# EAGLE design CC3200_Breakout (EAGLE 8.1.0)

## Sheet 1 of 2
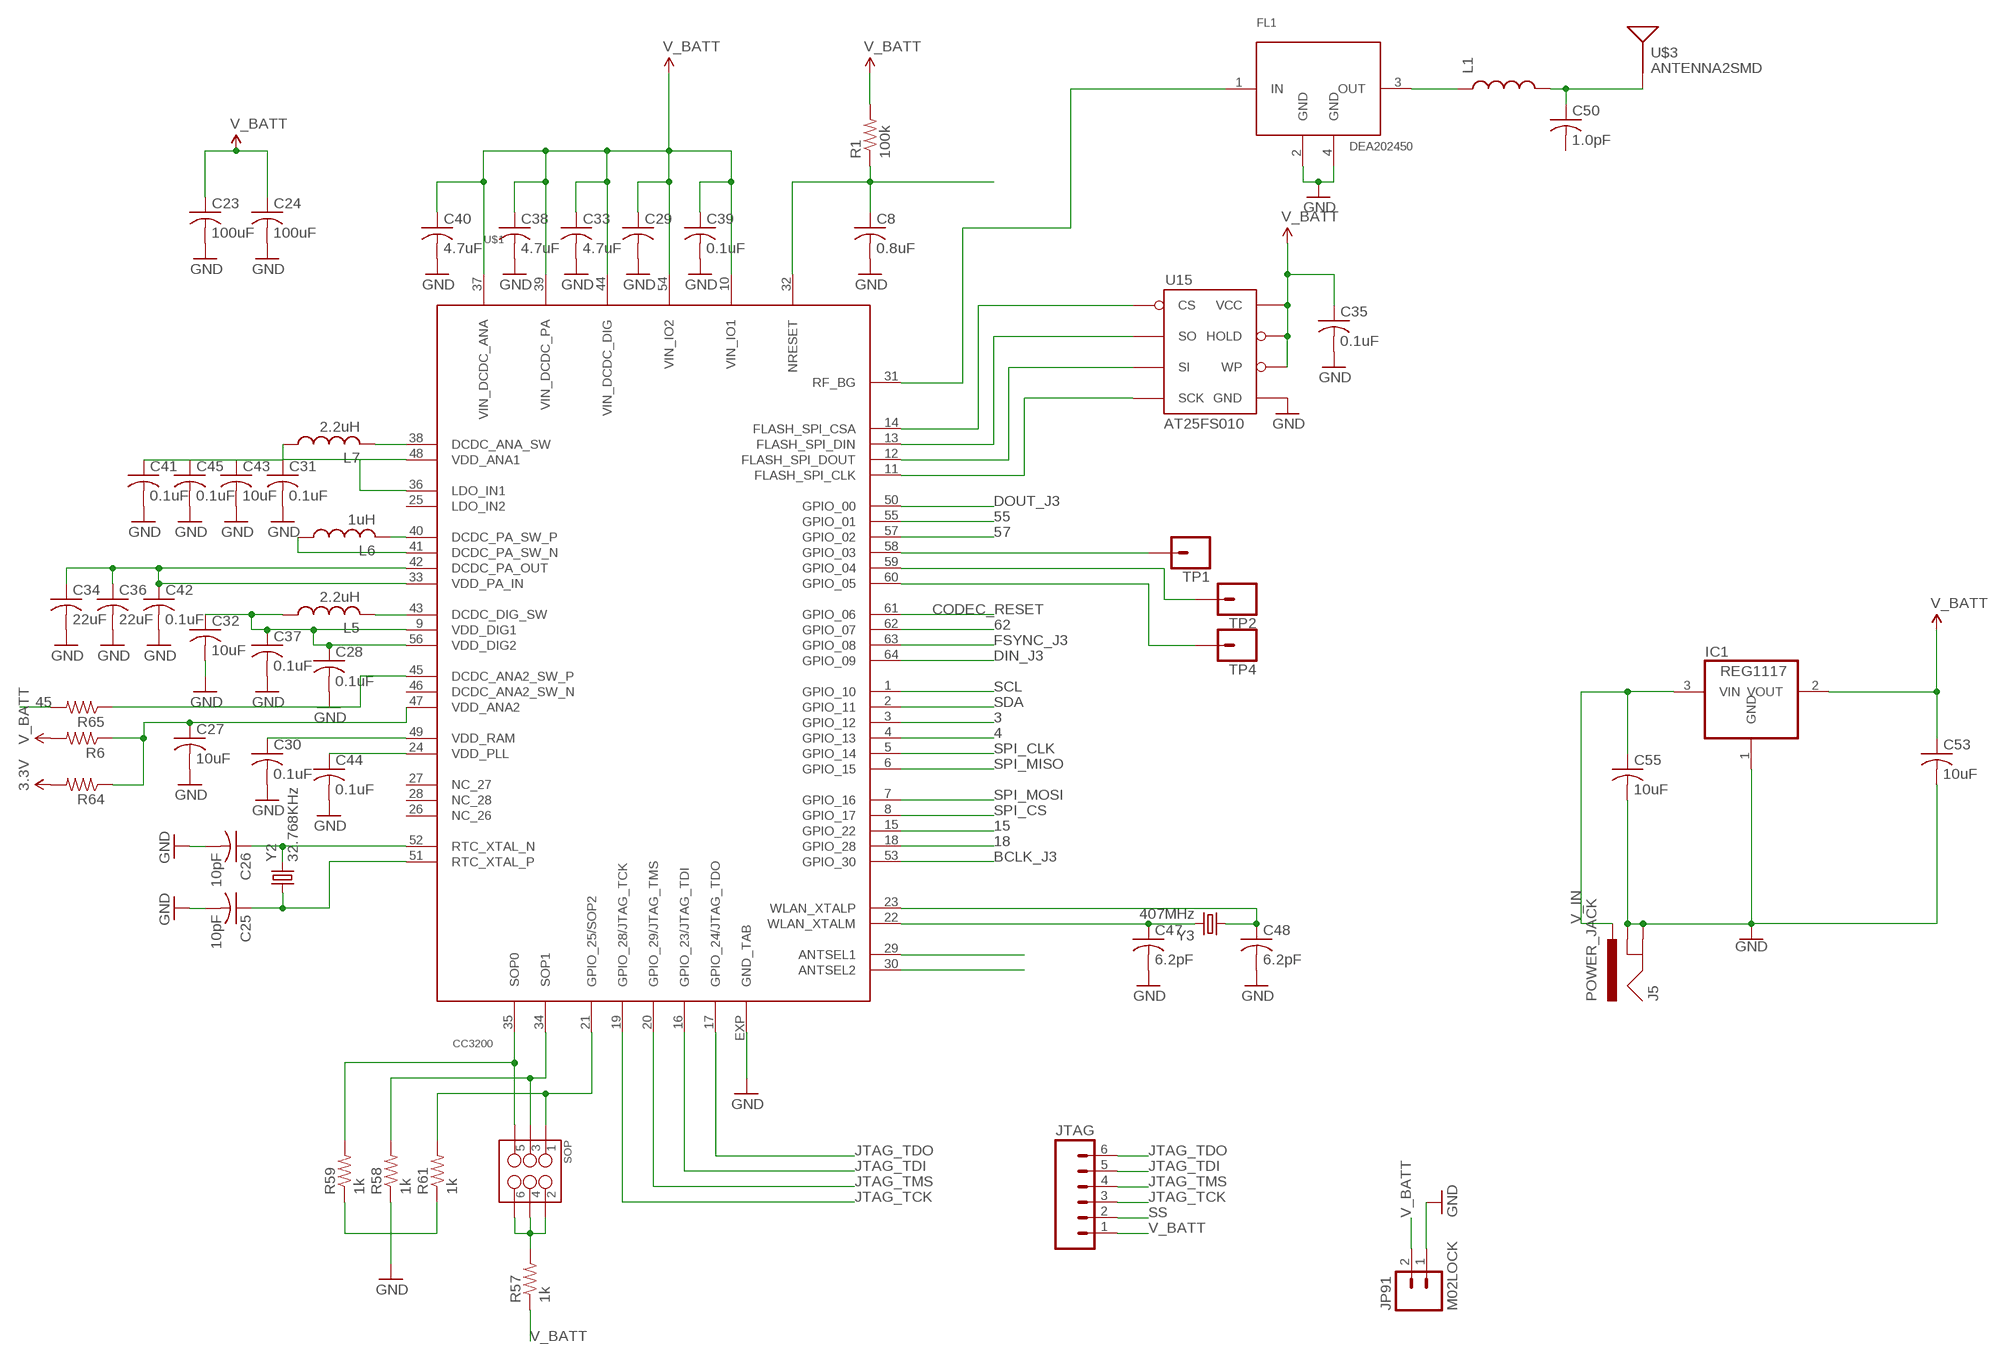
[diagram p0: schematic, sheet 1]

### Parts
C8  0.8uF  C-USC0402K  [C0402K]
C23  100uF  C-USC0402K  [C0402K]
C24  100uF  C-USC0402K  [C0402K]
C25  10pF  C-USC0402K  [C0402K]
C26  10pF  C-USC0402K  [C0402K]
C27  10uF  C-USC0402K  [C0402K]
C28  0.1uF  C-USC0402K  [C0402K]
C29  C-USC0402K  [C0402K]
C30  0.1uF  C-USC0402K  [C0402K]
C31  0.1uF  C-USC0402K  [C0402K]
C32  10uF  C-USC0402K  [C0402K]
C33  4.7uF  C-USC0402K  [C0402K]
C34  22uF  C-USC0402K  [C0402K]
C35  0.1uF  C-USC0402K  [C0402K]
C36  22uF  C-USC0402K  [C0402K]
C37  0.1uF  C-USC0402K  [C0402K]
C38  4.7uF  C-USC0402K  [C0402K]
C39  0.1uF  C-USC0402K  [C0402K]
C40  4.7uF  C-USC0402K  [C0402K]
C41  0.1uF  C-USC0402K  [C0402K]
C42  0.1uF  C-USC0402K  [C0402K]
C43  10uF  C-USC0402K  [C0402K]
C44  0.1uF  C-USC0402K  [C0402K]
C45  0.1uF  C-USC0402K  [C0402K]
C47  6.2pF  C-USC0402K  [C0402K]
C48  6.2pF  C-USC0402K  [C0402K]
C50  1.0pF  C-USC0402K  [C0402K]
C53  10uF  C-USC1206  [C1206]
C55  10uF  C-USC1206  [C1206]
FL1  DEA202450  [DEA202450]
IC1  REG1117  [SOT223]
J5  POWER_JACK  [POWER_JACK_PTH]
JP91  M02LOCK  [1X02_LOCK]
JTAG  M06SILK_FEMALE_PTH  [1X06]
L1  INDUCTOR-SPARKFUN0402  [C0402]
L5  2.2uH  L-USL2012C  [L2012C]
L6  1uH  L-USL2012C  [L2012C]
L7  2.2uH  L-USL2012C  [L2012C]
R1  100k  R-US_R0402  [R0402]
R6  R-US_R0402  [R0402]
R57  1k  R-US_R0402  [R0402]
R58  1k  R-US_R0402  [R0402]
R59  1k  R-US_R0402  [R0402]
R61  1k  R-US_R0402  [R0402]
R64  R-US_R0402  [R0402]
R65  R-US_R0402  [R0402]
SOP  M03X22X3_SILK_MALE_PTH  [2X3]
TP1  CONN_01  [1X01]
TP2  CONN_01  [1X01]
TP4  CONN_01  [1X01]
U15  AT25FS010  [SO08WIDE]
U$1  CC3200  [PVQFN-N64]
U$3  ANTENNA2SMD  [ANTENNA-CHIP2]
Y2  32.768KHz  CRYSTAL5X3  [CRYSTAL-SMD-5X3]
Y3  407MHz  CRYSTAL5X3  [CRYSTAL-SMD-5X3]

### Nets
3: U$1.3(GPIO_12)
3.3V: R64.2
4: U$1.4(GPIO_13)
15: U$1.15(GPIO_22)
18: U$1.18(GPIO_28)
45: R65.2
55: U$1.55(GPIO_01)
57: U$1.57(GPIO_02)
58: TP1.1 U$1.58(GPIO_03)
59: TP2.1 U$1.59(GPIO_04)
60: TP4.1 U$1.60(GPIO_05)
62: U$1.62(GPIO_07)
BCLK_J3: U$1.53(GPIO_30) ; also sheet 2
CODEC_RESET: U$1.61(GPIO_06) ; also sheet 2
DIN_J3: U$1.64(GPIO_09) ; also sheet 2
DOUT_J3: U$1.50(GPIO_00) ; also sheet 2
FSYNC_J3: U$1.63(GPIO_08) ; also sheet 2
JTAG_TCK: JTAG.3 U$1.19(GPIO_28/JTAG_TCK)
JTAG_TDI: JTAG.5 U$1.16(GPIO_23/JTAG_TDI)
JTAG_TDO: JTAG.6 U$1.17(GPIO_24/JTAG_TDO)
JTAG_TMS: JTAG.4 U$1.20(GPIO_29/JTAG_TMS)
N$1: C26.1 U$1.52(RTC_XTAL_N) Y2.3
N$2: C25.1 U$1.51(RTC_XTAL_P) Y2.1
N$3: C31.1 C41.1 C43.1 C45.1 L7.1 U$1.36(LDO_IN1) U$1.48(VDD_ANA1)
N$4: L7.2 U$1.38(DCDC_ANA_SW)
N$5: U$1.29(ANTSEL1)
N$6: R57.2 SOP.2 SOP.4 SOP.6
N$7: L6.2 U$1.40(DCDC_PA_SW_P)
N$8: L6.1 U$1.41(DCDC_PA_SW_N)
N$9: FL1.1(IN) U$1.31(RF_BG)
N$10: C34.1 C36.1 C42.1 U$1.33(VDD_PA_IN) U$1.42(DCDC_PA_OUT)
N$11: L5.2 U$1.43(DCDC_DIG_SW)
N$12: R65.1 U$1.45(DCDC_ANA2_SW_P)
N$13: R59.2 SOP.5 U$1.35(SOP0)
N$14: C8.1 R1.1 U$1.32(NRESET)
N$17: C28.1 C32.1 C37.1 L5.1 U$1.9(VDD_DIG1) U$1.56(VDD_DIG2)
N$18: C30.1 U$1.49(VDD_RAM)
N$19: C44.1 U$1.24(VDD_PLL)
N$20: C27.1 R6.1 R64.1 U$1.47(VDD_ANA2)
N$21: R58.2 SOP.3 U$1.34(SOP1)
N$22: R61.2 SOP.1 U$1.21(GPIO_25/SOP2)
N$27: U$1.30(ANTSEL2)
N$28: C47.1 U$1.22(WLAN_XTALM) Y3.3
N$29: C48.1 U$1.23(WLAN_XTALP) Y3.1
N$30: U15.1(CS) U$1.14(FLASH_SPI_CSA)
N$31: U15.2(SO) U$1.13(FLASH_SPI_DIN)
N$32: U15.5(SI) U$1.12(FLASH_SPI_DOUT)
N$33: U15.6(SCK) U$1.11(FLASH_SPI_CLK)
N$36: FL1.3(OUT) L1.1
SCL: U$1.1(GPIO_10) ; also sheet 2
SDA: U$1.2(GPIO_11) ; also sheet 2
SPI_CLK: U$1.5(GPIO_14)
SPI_CS: U$1.8(GPIO_17)
SPI_MISO: U$1.6(GPIO_15)
SPI_MOSI: U$1.7(GPIO_16)
SS: C8.2 C23.2 C24.2 C25.2 C26.2 C27.2 C28.2 C29.2 C30.2 C31.2 C32.2 C33.2 C34.2 C35.2 C36.2 C37.2 C38.2 C39.2 C40.2 C41.2 C42.2 C43.2 C44.2 C45.2 C47.2 C48.2 C50.1 C53.2 C55.2 FL1.2(GND) FL1.4(GND) IC1.1(GND) J5.GND J5.GNDBREAK JP91.1 JTAG.2 L1.2 R58.1 R59.1 R61.1 U15.4(GND) U$1.EXP(GND_TAB) U$3.FEED(SIGNAL) ; supply symbol labelled GND ; also sheet 2
V_BATT: C23.1 C24.1 C29.1 C33.1 C35.1 C38.1 C39.1 C40.1 C53.1 IC1.2(VOUT) JP91.2 JTAG.1 R1.2 R6.2 R57.1 U15.3(WP) U15.7(HOLD) U15.8(VCC) U$1.10(VIN_IO1) U$1.37(VIN_DCDC_ANA) U$1.39(VIN_DCDC_PA) U$1.44(VIN_DCDC_DIG) U$1.54(VIN_IO2)
V_IN: C55.1 IC1.3(VIN) J5.PWR
Unconnected: C50.2 U$1.25(LDO_IN2) U$1.26(NC_26) U$1.27(NC_27) U$1.28(NC_28) U$1.46(DCDC_ANA2_SW_N)

## Sheet 2 of 2
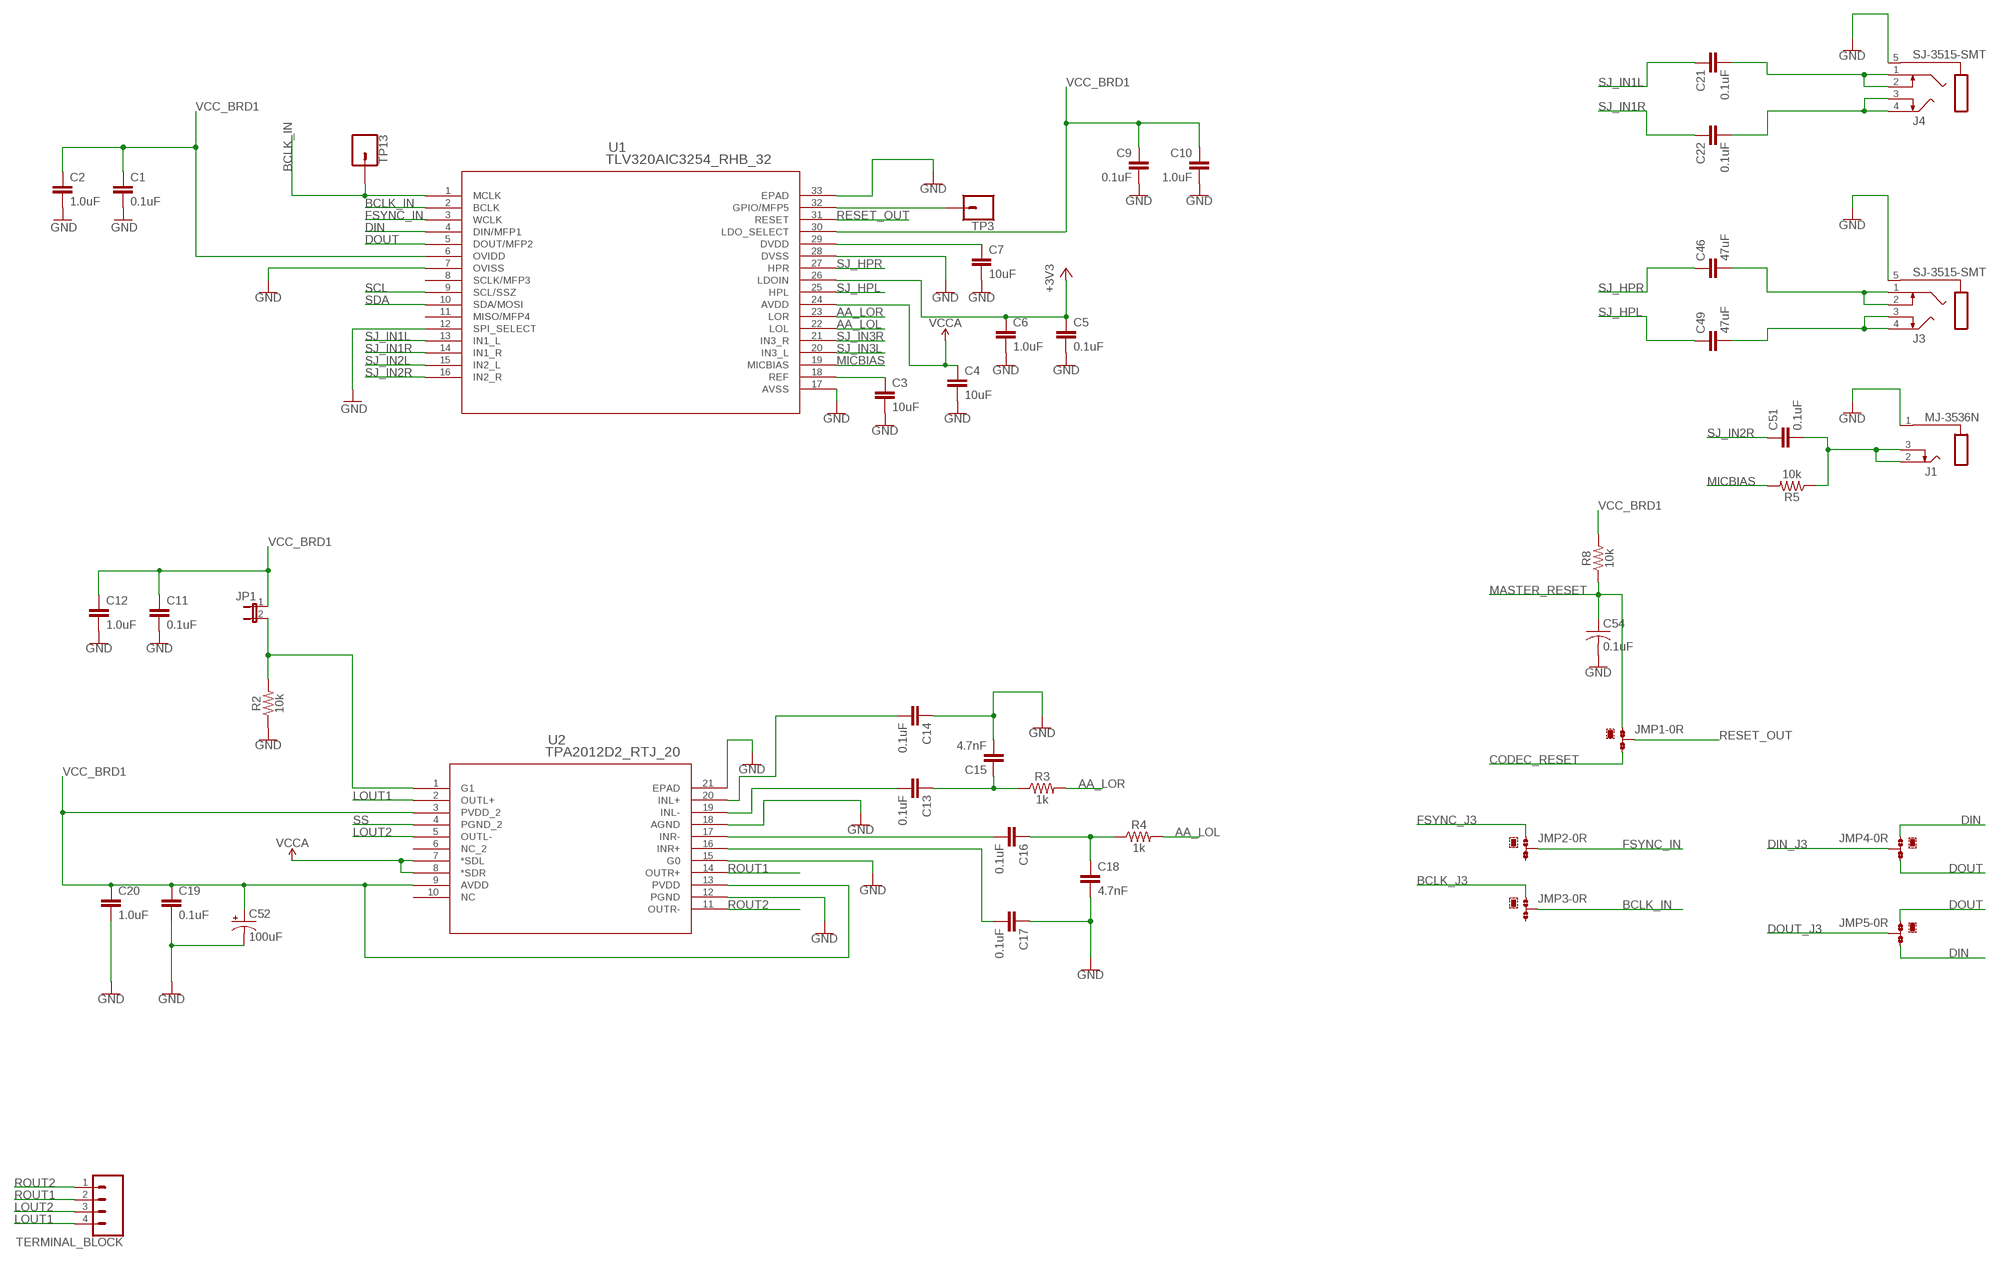
[diagram p1: schematic, sheet 2]

### Parts
C1  0.1uF  0.1UF-0402-16V-10%  [0402]
C2  1.0uF  1.0UF-0402-16V-10%  [0402]
C3  10uF  10UF-0603-6.3V-20%  [0603]
C4  10uF  10UF-0603-6.3V-20%  [0603]
C5  0.1uF  0.1UF-0402-16V-10%  [0402]
C6  1.0uF  1.0UF-0402-16V-10%  [0402]
C7  10uF  10UF-0603-6.3V-20%  [0603]
C9  0.1uF  0.1UF-0402-16V-10%  [0402]
C10  1.0uF  1.0UF-0402-16V-10%  [0402]
C11  0.1uF  0.1UF-0402-16V-10%  [0402]
C12  1.0uF  1.0UF-0402-16V-10%  [0402]
C13  0.1uF  0.1UF-0402-16V-10%  [0402]
C14  0.1uF  0.1UF-0402-16V-10%  [0402]
C15  4.7nF  4.7NF-50V-10%(0603)  [0603]
C16  0.1uF  0.1UF-0402-16V-10%  [0402]
C17  0.1uF  0.1UF-0402-16V-10%  [0402]
C18  4.7nF  4.7NF-50V-10%(0603)  [0603]
C19  0.1uF  0.1UF-0402-16V-10%  [0402]
C20  1.0uF  1.0UF-0402-16V-10%  [0402]
C21  0.1uF  0.1UF-0402-16V-10%  [0402]
C22  0.1uF  0.1UF-0402-16V-10%  [0402]
C46  47uF  0.1UF-0603-25V-5%  [0603]
C49  47uF  0.1UF-0603-25V-5%  [0603]
C51  0.1uF  0.1UF-0402-16V-10%  [0402]
C52  100uF  100UF-POLAR-25V-20%(ELEC)  [PANASONIC_D]
C54  0.1uF  C-USC0402K  [C0402K]
J1  MJ-3536N  [MJ-3536N]
J3  SJ-3515-SMT  [SJ-3515-SMT]
J4  SJ-3515-SMT  [SJ-3515-SMT]
JMP1  0R-JUMPA  [A0R-JMP]
JMP2  0R-JUMPA  [A0R-JMP]
JMP3  0R-JUMPA  [A0R-JMP]
JMP4  0R-JUMPA  [A0R-JMP]
JMP5  0R-JUMPA  [A0R-JMP]
JP1  JUMPER-2PTH  [1X02]
R2  10k  10KOHM-0603-1/10W-1%  [0603]
R3  1k  1KOHM-0603-1/10W-1%  [0603]
R4  1k  1KOHM-0603-1/10W-1%  [0603]
R5  10k  10KOHM-0603-1/10W-1%  [0603]
R8  10k  10KOHM-0603-1/10W-1%  [0603]
TERMINAL_BLOCK  CONN_04JST-PTH  [JST-4-PTH]
TP3  CONN_01  [1X01]
TP13  CONN_01  [1X01]
U1  TLV320AIC3254_RHB_32  [RHB32_3P45X3P45]
U2  TPA2012D2_RTJ_20  [RTJ20_2P7X2P7]

### Nets
+3V3: C5.1 C6.1 U1.26(LDOIN)
AA_LOL: R4.2 U1.22(LOL)
AA_LOR: R3.2 U1.23(LOR)
BCLK_IN: JMP3.2 TP13.1 U1.1(MCLK) U1.2(BCLK)
BCLK_J3: JMP3.1 ; also sheet 1
CODEC_RESET: JMP1.3 ; also sheet 1
DIN: JMP4.1 JMP5.3 U1.4(DIN/MFP1)
DIN_J3: JMP4.2 ; also sheet 1
DOUT: JMP4.3 JMP5.1 U1.5(DOUT/MFP2)
DOUT_J3: JMP5.2 ; also sheet 1
FSYNC_IN: JMP2.2 U1.3(WCLK)
FSYNC_J3: JMP2.1 ; also sheet 1
LOUT1: TERMINAL_BLOCK.4 U2.2(OUTL+)
LOUT2: TERMINAL_BLOCK.3 U2.5(OUTL-)
MASTER_RESET: C54.1 JMP1.1 R8.1
MICBIAS: R5.2 U1.19(MICBIAS)
N$25: C3.1 U1.18(REF)
N$34: TP3.1 U1.32(GPIO/MFP5)
N$35: JP1.2 R2.2 U2.1(G1)
N$37: C7.1 U1.29(DVDD)
N$38: C22.2 J4.3(TS) J4.4(T)
N$39: C14.2 U2.20(INL+)
N$41: C13.1 C15.1 R3.1
N$42: C13.2 U2.19(INL-)
N$43: C16.2 U2.17(INR-)
N$44: C16.1 C18.1 R4.1
N$45: C17.2 U2.16(INR+)
N$46: C21.2 J4.1(R) J4.2(RS)
N$55: C46.2 J3.1(R) J3.2(RS)
N$56: C49.2 J3.3(TS) J3.4(T)
N$57: C51.2 J1.2(T) J1.3(TS) R5.1
RESET_OUT: JMP1.2 U1.31(RESET)
ROUT1: TERMINAL_BLOCK.2 U2.14(OUTR+)
ROUT2: TERMINAL_BLOCK.1 U2.11(OUTR-)
SCL: U1.9(SCL/SSZ) ; also sheet 1
SDA: U1.10(SDA/MOSI) ; also sheet 1
SJ_HPL: C49.1 U1.25(HPL)
SJ_HPR: C46.1 U1.27(HPR)
SJ_IN1L: C21.1 U1.13(IN1_L)
SJ_IN1R: C22.1 U1.14(IN1_R)
SJ_IN2L: U1.15(IN2_L)
SJ_IN2R: C51.1 U1.16(IN2_R)
SJ_IN3L: U1.20(IN3_L)
SJ_IN3R: U1.21(IN3_R)
SS: C1.2 C2.2 C3.2 C4.2 C5.2 C6.2 C7.2 C9.2 C10.2 C11.2 C12.2 C14.1 C15.2 C17.1 C18.2 C19.2 C20.2 C52.- C54.2 J1.1(S) J3.5(S) J4.5(S) R2.1 U1.7(OVISS) U1.12(SPI_SELECT) U1.17(AVSS) U1.28(DVSS) U1.33(EPAD) U2.4(PGND_2) U2.12(PGND) U2.15(G0) U2.18(AGND) U2.21(EPAD) ; supply symbol labelled GND ; also sheet 1
VCC_BRD1: C1.1 C2.1 C9.1 C10.1 C11.1 C12.1 C19.1 C20.1 C52.+ JP1.1 R8.2 U1.6(OVIDD) U1.30(LDO_SELECT) U2.3(PVDD_2) U2.9(AVDD) U2.13(PVDD)
VCCA: C4.1 U1.24(AVDD) U2.7(*SDL) U2.8(*SDR)
Unconnected: JMP2.3 JMP3.3 U1.8(SCLK/MFP3) U1.11(MISO/MFP4) U2.6(NC_2) U2.10(NC)

## Library data of the parts
C1 C5 C9 C11 C13 C14 C16 C17 C19 C21 C22 C51 = SparkFun-Capacitors:0.1UF: 0.1µF ceramic capacitors A capacitor is a passive two-terminal electrical component used to store electrical energy temporarily in an electric field.; PROD_ID: CAP-12416
C2 C6 C10 C12 C20 = SparkFun-Capacitors:1.0UF: 1µF ceramic capacitors A capacitor is a passive two-terminal electrical component used to store electrical energy temporarily in an electric field.; PROD_ID: CAP-12417
C3 C4 C7 = SparkFun-Capacitors:10UF: 10.0µF ceramic capacitors A capacitor is a passive two-terminal electrical component used to store electrical energy temporarily in an electric field.; PROD_ID: CAP-11015
C8 C23-C45 C47 C48 C50 C54 = resistor:C-US: CAPACITOR, American symbol
C15 C18 = SparkFun-Retired:4.7NF-50V-10%(0603): CAP-11378; PROD_ID: CAP-11378
C46 C49 = SparkFun-Capacitors:0.1UF: 0.1µF ceramic capacitors A capacitor is a passive two-terminal electrical component used to store electrical energy temporarily in an electric field.; PROD_ID: CAP-08604; VALUE: 0.1uF
C52 = SparkFun-Capacitors:100UF-POLAR: 100µF polarized capacitors A capacitor is a passive two-terminal electrical component used to store electrical energy temporarily in an electric field.; PROD_ID: CAP-12547
C53 C55 = rcl:C-US: CAPACITOR, American symbol
FL1 = DEA202450:DEA202450
IC1 = burr-brown:REG1117: 800mA and 1A Low Dropout (LDO) Positive Regulator 1.8V, 2.5V, 2.85V, 3.3V, 5V, and Adj; MPN: REG1117; OC_FARNELL: 1097566; OC_NEWARK: 14P6981
J1 = con-cuistack:MJ-3536N: Mono Audio Jack, 3.5 MM
J3 J4 = con-cuistack:SJ-3515: 3.5 Stereo Audio Jack (SMT)
J5 = SparkFun-Connectors:POWER_JACK: Power Jack Connector This is the standard 5.5mm barrel jack for power. The PTH is the most common, proven, reliable, footprint. The Slot footprint only works if the mill layer is transmitted to the PCB fab house so be warned. Here are the connectors we sell at SparkFun: DC Barrel Power Jack/Connector <https://www.sparkfun.com/products/119> (PRT-00119) DC Barrel Power Jack/Connector (SMD) <https://www.sparkfun.com/products/12748> (PRT-12748) DC Barrel Jack Adapter - Breadboard Compatible <https://www.sparkfun.com/products/10811> (PRT-10811) It is used on this SparkFun product (and many, many others): SparkFun RedBoard - Programmed with Arduino <https://www.sparkfun.com/products/12757> (DEV-12757) Also, if you need a mating power supply or connector, please check these out: Wall Adapter Power Supply - 9VDC 650mA <https://www.sparkfun.com/products/298> (TOL-00298) DC Barrel Jack Adapter - Male <https://www.sparkfun.com/products/10287> (PRT-10287); PROD_ID: CONN-08197
JMP1-JMP5 = jump-0r-smd:0R-JUMP: SMD 0R 0805 Jumper
JP1 = SparkFun-Retired:JUMPER-2: Jumper Basic 0.1" spaced jumper. Use with breakaway headers.
JP91 = SparkFun-Connectors:M02: Standard 2-pin 0.1" header. Use with - straight break away headers ( PRT-00116) - right angle break away headers (PRT-00553) - swiss pins (PRT-00743) - machine pins (PRT-00117) - female headers (PRT-00115) Molex polarized connector foot print use with: PRT-08233 with associated crimp pins and housings. 2.54_SCREWTERM for use with PRT-10571. 3.5mm Screw Terminal footprints for PRT-08084 5mm Screw Terminal footprints for use with PRT-08432
JTAG = SparkFun-Connectors:M06: Header 6 Standard 6-pin 0.1" header. Use with straight break away headers (SKU : PRT-00116), right angle break away headers (PRT-00553), swiss pins (PRT-00743), machine pins (PRT-00117), and female headers (PRT-00115). Molex polarized connector foot print use with SKU : PRT-08094 with associated crimp pins and housings. NOTES ON THE VARIANTS LOCK and LOCK_LONGPADS... This footprint was designed to help hold the alignment of a through-hole component (i.e. 6-pin header) while soldering it into place. You may notice that each hole has been shifted either up or down by 0.005 of an inch from it's more standard position (which is a perfectly straight line). This slight alteration caused the pins (the squares in the middle) to touch the edges of the holes. Because they are alternating, it causes a "brace" to hold the component in place. 0.005 has proven to be the perfect amount of "off-center" position when using our standard breakaway headers. Although looks a little odd when you look at the bare footprint, once you have a header in there, the alteration is very hard to notice. Also,if you push a header all the way into place, it is covered up entirely on the bottom side. This idea of altering the position of holes to aid alignment will be further integrated into the Sparkfun Library for other footprints. It can help hold any component with 3 or more connection pins.; PROD_ID: CONN-08437
L1 = Spark:INDUCTOR-SPARKFUN: Inductors Basic Inductor/Choke - 0603 and 1206. Footprints are not proven and vary greatly between part numbers. SRN6045- 33uH, 20% 1.4A
L5-L7 = resistor:L-US: INDUCTOR, American symbol
R1 R6 R57-R59 R61 R64 R65 = resistor:R-US_: RESISTOR, American symbol
R2 R5 R8 = SparkFun-Resistors:10KOHM: 10kΩ resistor A resistor is a passive two-terminal electrical component that implements electrical resistance as a circuit element. Resistors act to reduce current flow, and, at the same time, act to lower voltage levels within circuits. - Wikipedia; PROD_ID: RES-00824
R3 R4 = SparkFun-Resistors:1KOHM: 1kΩ resistor A resistor is a passive two-terminal electrical component that implements electrical resistance as a circuit element. Resistors act to reduce current flow, and, at the same time, act to lower voltage levels within circuits. - Wikipedia; PROD_ID: RES-07856
SOP = SparkFun-Connectors:M03X2: 2x3 .1" header. Shrouded, with keying- CONN-10681 SMT- CONN-11415 Pogo pins- HW-11044; PROD_ID: CONN-09701
TERMINAL_BLOCK = SparkFun-Connectors:CONN_04: Multi connection point. Often used as Generic Header-pin footprint for 0.1 inch spaced/style header connections On any of the 0.1 inch spaced packages, you can populate with these: Break Away Headers - Straight <https://www.sparkfun.com/products/116> (PRT-00116) Break Away Male Headers - Right Angle <https://www.sparkfun.com/products/553> (PRT-00553) Female Headers <https://www.sparkfun.com/products/115> (PRT-00115) Break Away Headers - Machine Pin <https://www.sparkfun.com/products/117> (PRT-00117) Break Away Female Headers - Swiss Machine Pin <https://www.sparkfun.com/products/743> (PRT-00743) For SCREWTERMINALS and SPRING TERMINALS visit here: Screw Terimnals on SparkFun.com <https://www.sparkfun.com/search/results?term=Screw+Terminals> (5mm/3.5mm/2.54mm spacing) This device is also useful as a general connection point to wire up your design to another part of your project. Our various solder wires solder well into these plated through hole pads. Hook-Up Wire - Assortment (Stranded, 22 AWG) <https://www.sparkfun.com/products/11375> (PRT-11375) Hook-Up Wire - Assortment (Solid Core, 22 AWG) <https://www.sparkfun.com/products/11367> (PRT-11367) View the entire wire category on our website here <https://www.sparkfun.com/categories/141> Special notes: Molex polarized connector foot print use with SKU : PRT-08231 with associated crimp pins and housings. 1MM SMD Version SKU: PRT-10208; PROD_ID: WIRE-13531; SF_ID: PRT-09916
TP1-TP4 TP13 = SparkFun-Connectors:CONN_01: Single connection point. Often used as Generic Header-pin footprint for 0.1 inch spaced/style header connections On any of the 0.1 inch spaced packages, you can populate with these: Break Away Headers - Straight <https://www.sparkfun.com/products/116> (PRT-00116) Break Away Male Headers - Right Angle <https://www.sparkfun.com/products/553> (PRT-00553) Female Headers <https://www.sparkfun.com/products/115> (PRT-00115) Break Away Headers - Machine Pin <https://www.sparkfun.com/products/117> (PRT-00117) Break Away Female Headers - Swiss Machine Pin <https://www.sparkfun.com/products/743> (PRT-00743) This device is also useful as a general connection point to wire up your design to another part of your project. Our various solder wires solder well into these plated through hole pads. Hook-Up Wire - Assortment (Stranded, 22 AWG) <https://www.sparkfun.com/products/11375> (PRT-11375) Hook-Up Wire - Assortment (Solid Core, 22 AWG) <https://www.sparkfun.com/products/11367> (PRT-11367) View the entire wire category on our website here <https://www.sparkfun.com/categories/141> Special notes: SMTSO-256-ET is a "flush mount" nut for a 4-40 screw. We mostly use this on specialty testbeds; it is a nice way to connect hardware to your PCB at an adjustable hieght. Also note, the SNAP packages are for using a snappable style connector. We sell a baggie of snaps and they are also used on two LilyPad designs: Snap Assortment - 30 pack (male and female) <https://www.sparkfun.com/products/11347> (DEV-11347) LilyPad Arduino SimpleSnap <https://www.sparkfun.com/products/10941> (DEV-10941) LilyPad SimpleSnap Protoboard <https://www.sparkfun.com/products/10940> (DEV-10940)
U1 = TLV320AIC3254:TLV320AIC3254_RHB_32; DATASHEETURL: httpwww.ti.comlitgpnTLV320AIC3254; FAMILY_NAME: Audio CODEC; GENERIC_PART_NUMBER: TLV320AIC3254; INDUSTRY_STD_PKG_TYPE: QFN; MANUFACTURER: Texas Instruments; MANUFACTURER_PART_NUMBER: tlv320aic3254_rhb_32; PACKAGE_DESIGNATOR: RHB; PIN_COUNT: 32; VENDOR: Texas Instruments
U2 = TPA2012D2_RTJ_20:TPA2012D2_RTJ_20; DATASHEETURL: httpwww.ti.comlitgpnTPA2012D2; FAMILY_NAME: DYNAMIC SPEAKER; GENERIC_PART_NUMBER: TPA2012D2; INDUSTRY_STD_PKG_TYPE: QFN; MANUFACTURER: Texas Instruments; MANUFACTURER_PART_NUMBER: tpa2012d2_rtj_20; PACKAGE_DESIGNATOR: RTJ; PIN_COUNT: 20; VENDOR: Texas Instruments
U15 = SparkFun-DigitalIC:AT25FS010: 1-Mbit SPI flash memory
U$1 = cc3200:CC3200
U$3 = SparkFun-RF:ANTENNA2: Chip antenna Single endded antenna. Common with smaller chip antennas. CHIP4 package is the GPS Chip Antenna SKU: GPS-08418. CHIP5 package is 2.4GHz chip antenna SKU: WRL-00144.
Y2 Y3 = SparkFun-FreqCtrl:CRYSTAL: Various standard crystals. Proven footprints. Spark Fun Electronics SKU : COM-00534

## Board
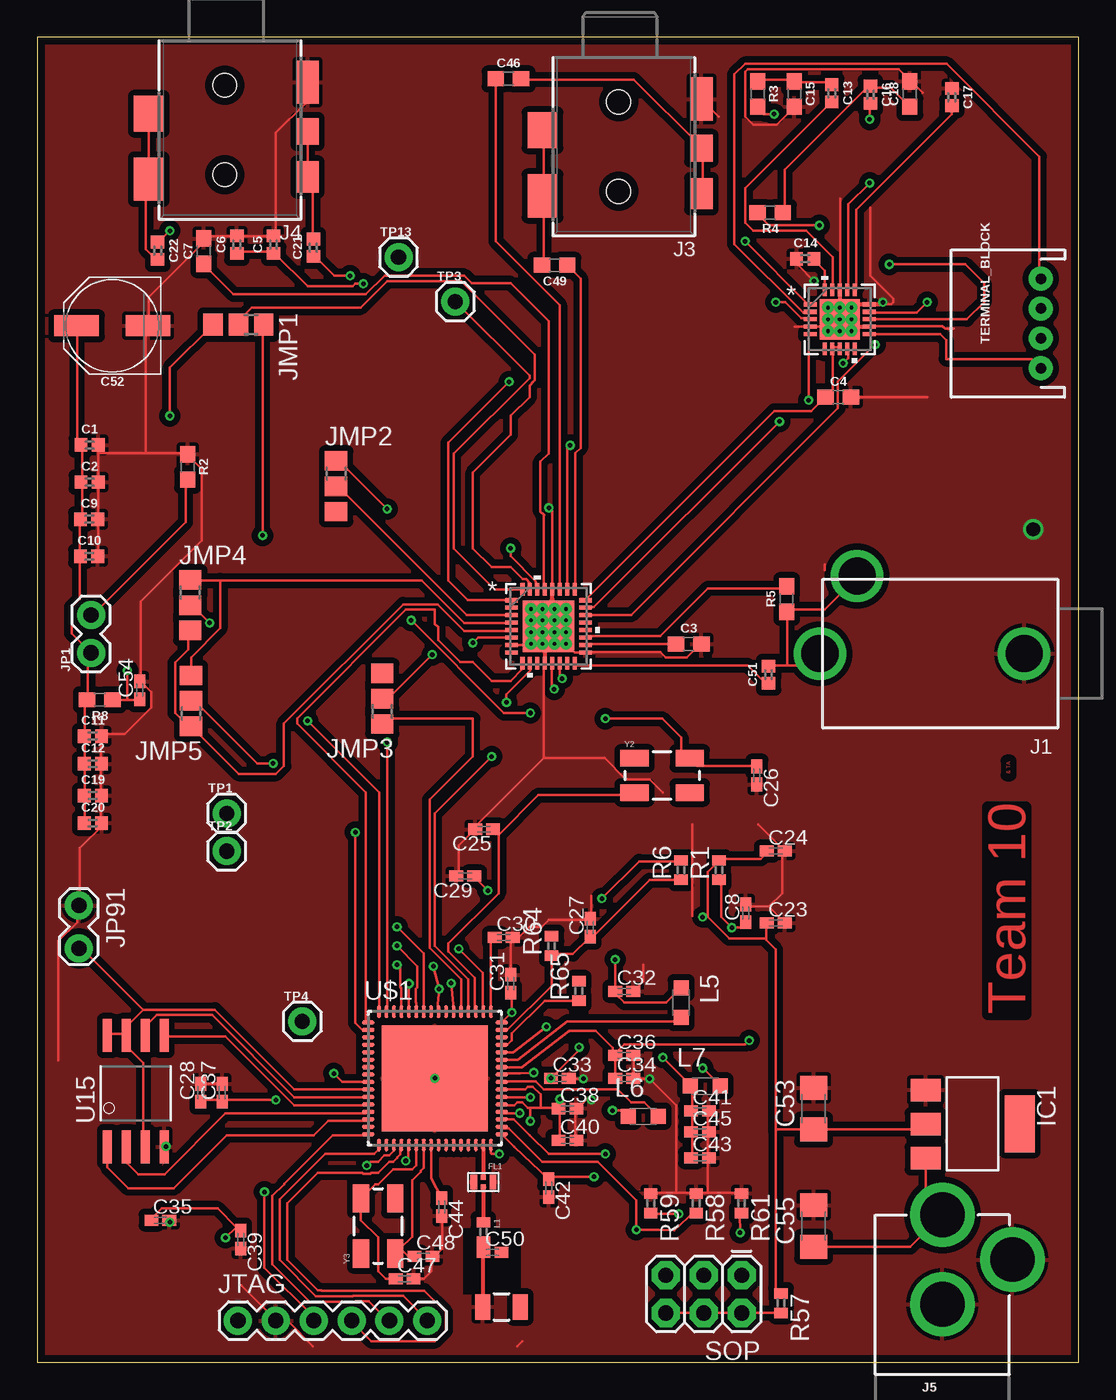
[diagram p2: board, top side]
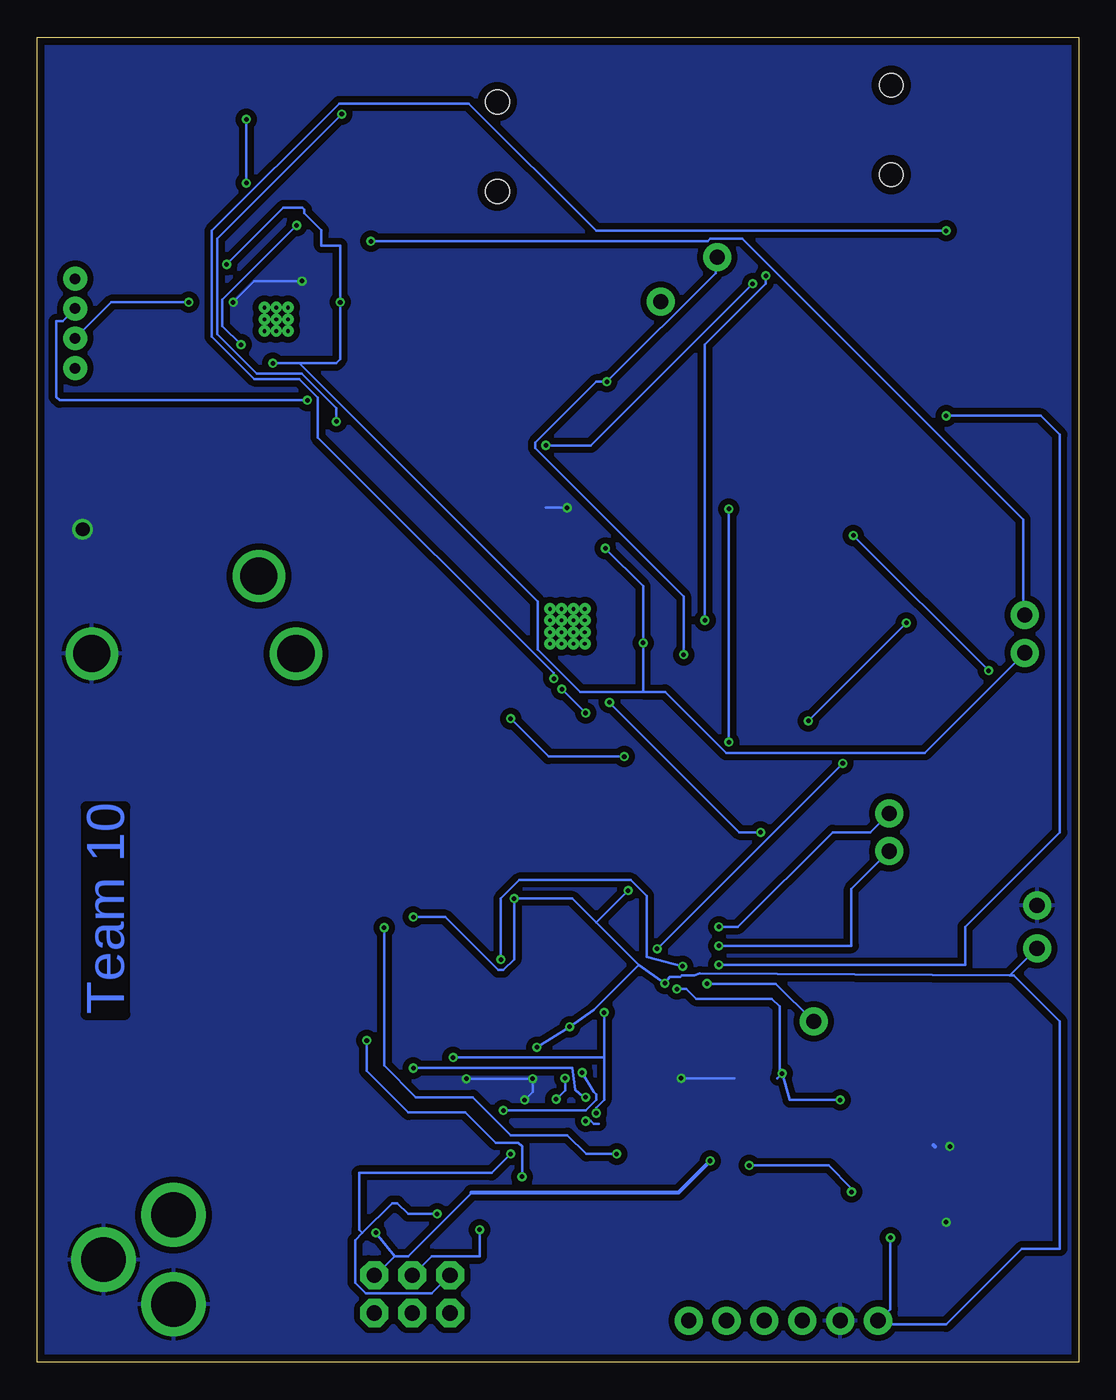
[diagram p3: board, bottom side, seen from below]

Size 69.85 x 88.9 mm. Coordinates in mm from the lower left corner, seen from the top.
Outline: 0,0 69.85,0 69.85,88.9 0,88.9 0,0
Copper layers (1*2*15*16): Top 0.035mm / dielectric 1.5mm / Route2 0.035mm / dielectric 0.15mm / Route15 0.035mm / dielectric 0.2mm / Bottom 0.035mm
Design rules "EagleRules *": minimum track width 7mil, minimum drill 12mil, track to track 7mil, track to pad 7mil, pad to pad 7mil, via to via 7mil, smd to smd 0mil, copper to edge 20mil, drill to drill 10mil, minimum pad ring 10mil, minimum via ring 6mil, stop-mask expansion 2mil, vias tented up to drill 25mil, thermal gap 10mil

### Footprints (pad centres in the part's own frame; a part is rotated, then mirrored left to right if it is on the bottom)
0402 = smd 0.85 x 0.9: 1 -0.58,0; 2 0.58,0
0603 = smd 1.1 x 1: 1 -0.85,0; 2 0.85,0
C0402K = smd 0.925 x 0.74: 1 -0.6,0; 2 0.6,0
PANASONIC_D = smd 3 x 1.4: + 2.4,0; - -2.4,0
C1206 = smd 1.6 x 1.8: 1 -1.4,0; 2 1.4,0
DEA202450 = smd 0.35 x 0.35: 1 0,-0.325; 3 0,0.325 | smd 0.45 x 1: 2 0.65,0; 4 -0.65,0
SOT223 = smd 1.499 x 2.007: 1 -2.261,-3.15; 2 0.025,-3.15; 3 2.311,-3.15 | smd 3.81 x 2.007: 4 0,3.15
MJ-3536N = drill 2.5: 1 0,0; 2 0,13.7; 3 5.2,11.2
SJ-3515-SMT = smd 1.5 x 2.1: 1 -5.45,3.15 | smd 1.5 x 1.8: 2 -5.45,0.1 | smd 2 x 2.4: 3 5.2,-1.1 | smd 2 x 2.9: 4 5.2,3.3 | smd 1.5 x 2.9: 5 -5.45,-3.2 | hole 1.6: 0.1,3; 0.1,-3
POWER_JACK_PTH = drill 2.997 pad 4.318: GND 0,7.7; GNDBREAK 4.7,10.7; PWR 0,13.7
A0R-JMP = smd 1.5 x 1.3: 1 0,1.7; 2 0,0; 3 0,-1.7
1X02 = drill 1.016 pad 1.88: 1 0,0; 2 2.54,0
1X02_LOCK = drill 1.016 pad 1.88: 1 -0.178,0; 2 2.718,0
1X06 = drill 1.016 pad 1.88: 1 0,0; 2 2.54,0; 3 5.08,0; 4 7.62,0; 5 10.16,0; 6 12.7,0
C0402 = smd 0.7 x 0.9: 1 -0.65,0; 2 0.65,0
L2012C = smd 1 x 1: 1 -1,0; 2 1,0
R0402 = smd 0.7 x 0.9: 1 -0.65,0; 2 0.65,0
2X3 = drill 1.016 pad 1.88 octagon: 1 0,0; 2 0,2.54; 3 2.54,0; 4 2.54,2.54; 5 5.08,0; 6 5.08,2.54
JST-4-PTH = drill 0.7 pad 1.6: 1 -3,0; 2 -1,0; 3 1,0; 4 3,0
1X01 = drill 1.016 pad 1.88: 1 0,0
RHB32_3P45X3P45 = smd 0.85 x 0.28: 1 -2.475,1.75; 2 -2.475,1.25; 3 -2.475,0.75; 4 -2.475,0.25; 5 -2.475,-0.25; 6 -2.475,-0.75; 7 -2.475,-1.25; 8 -2.475,-1.75; 17 2.475,-1.75; 18 2.475,-1.25; 19 2.475,-0.75; 20 2.475,-0.25; 21 2.475,0.25; 22 2.475,0.75; 23 2.475,1.25; 24 2.475,1.75 | smd 0.28 x 0.85: 9 -1.75,-2.475; 10 -1.25,-2.475; 11 -0.75,-2.475; 12 -0.25,-2.475; 13 0.25,-2.475; 14 0.75,-2.475; 15 1.25,-2.475; 16 1.75,-2.475; 25 1.75,2.475; 26 1.25,2.475; 27 0.75,2.475; 28 0.25,2.475; 29 -0.25,2.475; 30 -0.75,2.475; 31 -1.25,2.475; 32 -1.75,2.475 | smd 3.45 x 3.45: 33 0,0 | drill 0.254 pad 0.508: V -1.168,-1.168; V_1 -1.168,-0.406; V_2 -1.168,0.406; V_3 -1.168,1.168; V_4 -0.406,-1.168; V_5 -0.406,-0.406; V_6 -0.406,0.406; V_7 -0.406,1.168; V_8 0.406,-1.168; V_9 0.406,-0.406; V_10 0.406,0.406; V_11 0.406,1.168; V_12 1.168,-1.168; V_13 1.168,-0.406; V_14 1.168,0.406; V_15 1.168,1.168
RTJ20_2P7X2P7 = smd 0.85 x 0.28: 1 -1.975,1; 2 -1.975,0.5; 3 -1.975,0; 4 -1.975,-0.5; 5 -1.975,-1; 11 1.975,-1; 12 1.975,-0.5; 13 1.975,0; 14 1.975,0.5; 15 1.975,1 | smd 0.28 x 0.85: 6 -1,-1.975; 7 -0.5,-1.975; 8 0,-1.975; 9 0.5,-1.975; 10 1,-1.975; 16 1,1.975; 17 0.5,1.975; 18 0,1.975; 19 -0.5,1.975; 20 -1,1.975 | smd 2.7 x 2.7: 21 0,0 | drill 0.254 pad 0.508: V -0.787,-0.787; V_1 -0.787,0; V_2 -0.787,0.787; V_3 0,-0.787; V_4 0,0; V_5 0,0.787; V_6 0.787,-0.787; V_7 0.787,0; V_8 0.787,0.787
SO08WIDE = smd 0.61 x 2.21: 1 -1.905,-3.569; 2 -0.635,-3.569; 3 0.635,-3.569; 4 1.905,-3.569; 5 1.905,3.886; 6 0.635,3.886; 7 -0.635,3.886; 8 -1.905,3.886
PVQFN-N64 = smd 0.85 x 0.28: 1 -4.475,3.75; 2 -4.475,3.25; 3 -4.475,2.75; 4 -4.475,2.25; 5 -4.475,1.75; 6 -4.475,1.25; 7 -4.475,0.75; 8 -4.475,0.25; 9 -4.475,-0.25; 10 -4.475,-0.75; 11 -4.475,-1.25; 12 -4.475,-1.75; 13 -4.475,-2.25; 14 -4.475,-2.75; 15 -4.475,-3.25; 16 -4.475,-3.75; 33 4.475,-3.75; 34 4.475,-3.25; 35 4.475,-2.75; 36 4.475,-2.25; 37 4.475,-1.75; 38 4.475,-1.25; 39 4.475,-0.75; 40 4.475,-0.25; 41 4.475,0.25; 42 4.475,0.75; 43 4.475,1.25; 44 4.475,1.75; 45 4.475,2.25; 46 4.475,2.75; 47 4.475,3.25; 48 4.475,3.75 | smd 0.28 x 0.85: 17 -3.75,-4.475; 18 -3.25,-4.475; 19 -2.75,-4.475; 20 -2.25,-4.475; 21 -1.75,-4.475; 22 -1.25,-4.475; 23 -0.75,-4.475; 24 -0.25,-4.475; 25 0.25,-4.475; 26 0.75,-4.475; 27 1.25,-4.475; 28 1.75,-4.475; 29 2.25,-4.475; 30 2.75,-4.475; 31 3.25,-4.475; 32 3.75,-4.475; 49 3.75,4.475; 50 3.25,4.475; 51 2.75,4.475; 52 2.25,4.475; 53 1.75,4.475; 54 1.25,4.475; 55 0.75,4.475; 56 0.25,4.475; 57 -0.25,4.475; 58 -0.75,4.475; 59 -1.25,4.475; 60 -1.75,4.475; 61 -2.25,4.475; 62 -2.75,4.475; 63 -3.25,4.475; 64 -3.75,4.475 | smd 7.112 x 7.112: EXP 0,0
ANTENNA-CHIP2 = smd 1.7 x 1: FEED 0,1.25; P$2 0,-1.25
CRYSTAL-SMD-5X3 = smd 1.9 x 1.1: 1 -1.85,-1.15; 2 1.85,-1.15; 3 1.85,1.15; 4 -1.85,1.15

### Placement (x,y rotation side)
C1  3.51,61.54 0 top
C2  3.51,59.05 0 top
C3  43.69,48.18 0 top
C4  53.72,64.74 0 top
C5  15.85,74.98 90 top
C6  13.39,74.98 90 top
C7  11.18,74.55 90 top
C8  47.52,30.12 90 top
C9  3.48,56.57 0 top
C10  3.48,54.08 0 top
C11  3.73,42.01 0 top
C12  3.73,40.16 0 top
C13  53.29,85.14 270 top
C14  51.51,74.04 0 top
C15  50.77,85.09 270 top
C16  55.88,85.04 270 top
C17  61.34,84.89 270 top
C18  58.52,85.09 90 top
C19  3.73,38.02 0 top
C20  3.73,36.17 0 top
C21  18.52,74.78 90 top
C22  8.08,74.57 270 top
C23  49.53,29.46 0 top
C24  49.53,34.29 0 top
C25  29.97,35.76 180 top
C26  48.26,39.37 270 top
C27  37.08,29.16 90 top
C28  10.97,18.08 90 top
C29  28.7,32.61 180 top
C30  31.29,28.5 0 top
C31  31.75,25.4 90 top
C32  39.37,24.89 0 top
C33  35.05,19.05 0 top
C34  39.37,19.05 0 top
C35  8.26,9.53 0 top
C36  39.37,20.57 0 top
C37  12.4,18.08 90 top
C38  35.56,17.02 0 top
C39  13.64,8.23 270 top
C40  35.56,14.88 0 top
C41  44.45,16.87 0 top
C42  34.29,11.68 270 top
C43  44.45,13.72 0 top
C44  27.13,10.41 270 top
C45  44.45,15.44 0 top
C46  31.6,86.11 0 top
C47  24.64,5.59 0 top
C48  25.91,7.11 0 top
C49  34.7,73.61 180 top
C50  30.53,7.37 0 top
C51  49.05,46.13 90 top
C52  5.03,69.55 180 top
C53  52.07,17.02 90 top
C54  6.86,45.09 90 top
C55  52.07,9.14 90 top
FL1  29.92,12.09 180 top
IC1  62.74,16 270 top
J1  66.19,47.55 90 top
J3  39.09,81.56 180 top
J4  12.67,82.68 180 top
J5  60.71,-3.81 0 top
JMP1  13.49,69.62 270 top
JMP2  20.04,58.78 0 top
JMP3  23.14,44.53 180 top
JMP4  10.26,50.8 0 top
JMP5  10.31,44.37 180 top
JP1  3.61,47.6 90 top
JP91  2.79,30.48 270 top
JTAG  13.46,2.79 0 top
L1  29.92,8.74 270 top
L5  43.18,24.13 270 top
L6  40.64,16.51 0 top
L7  44.81,18.54 0 top
R1  45.72,33.02 90 top
R2  10.08,60.07 270 top
R3  48.31,85.09 270 top
R4  49.15,77.14 180 top
R5  50.27,51.21 90 top
R6  43.18,33.02 90 top
R8  4.19,44.45 180 top
R57  49.89,3.96 270 top
R58  44.2,10.67 270 top
R59  41.15,10.67 270 top
R61  47.24,10.67 270 top
R64  34.49,27.94 90 top
R65  36.32,24.92 90 top
SOP  47.24,5.84 180 top
TERMINAL_BLOCK  67.31,69.7 90 top
TP1  12.7,36.83 0 top
TP2  12.7,34.29 0 top
TP3  28.04,71.17 0 top
TP4  17.78,22.86 0 top
TP13  24.23,74.14 0 top
U1  34.29,49.38 0 top
U2  53.82,69.98 0 top
U15  6.6,18.03 0 top
U$1  26.67,19.05 0 top
U$3  31.14,3.71 90 top
Y2  41.91,39.37 0 top
Y3  22.86,9.14 90 top

### Tracks (layer width: path | path; a pad name or v marks a point on that pad's centre or on a via)
58  (via drill 0.3)
  Top 0.178: v24.13,29.21 25.92,27.42 U$1.58
  Bottom 0.178: v24.13,29.21 22.86,29.21 16.51,35.56 13.97,35.56 TP1.1
59  (via drill 0.3)
  Top 0.178: U$1.59 25.42,24.12 25.39,24.15 25.39,25.05 25.5,25.16 25.5,26.57 v24.13,27.94
  Bottom 0.178: v24.13,27.94 15.24,27.94 15.24,31.75 TP2.1
60  (via drill 0.3)
  Top 0.178: U$1.60 24.92,24.63 v24.93,25.4
  Bottom 0.178: v24.93,25.4 20.32,25.4 TP4.1
+3V3  (via drill 0.3)
  Top 0.178: v35.74,61.52 35.56,61.34 35.56,51.92 U1.26 | v21.87,72.36 21.34,72.36 21.16,72.19 18.14,72.19 16,74.32 C5.1 15.82,74.5 13.51,74.5 C6.1
  Bottom 0.178: v35.74,61.52 32.72,61.52 v21.87,72.36
AA_LOL  (via drill 0.3)
  Top 0.178: v56.19,68.28 53.7,65.79 53.7,64.01 39.83,50.14 36.8,50.14 U1.22 | v52.45,76.28 49.07,76.28 48.36,76.99 R4.2
  Bottom 0.178: v56.19,68.28 57.43,69.52 57.43,71.3 v52.45,76.28
AA_LOR  (via drill 0.3)
  Top 0.178: v49.78,63.12 37.34,50.67 36.8,50.67 U1.23 | v49.43,83.74 48.72,83.74 48.36,84.1 R3.2
  Bottom 0.178: v49.78,63.12 49.78,64.01 52.09,66.32 55.12,66.32 57.78,68.99 57.78,75.39 v49.43,83.74
BCLK_IN  (via drill 0.3)
  Top 0.178: U1.2 31.83,50.67 31.83,51.03 U1.1 | 31.65,51.21 U1.1 | v26.49,47.47 23.65,44.63 23.29,44.63 JMP3.2 | U1.1 28.88,51.13 27.56,52.45 27.56,61.7 v31.65,65.79
  Bottom 0.178: TP13.1 24.36,74.14 24.36,73.08 v31.65,65.79 32.36,65.79 36.45,61.7 36.45,61.34 26.49,51.38 v26.49,47.47
BCLK_J3
  Top 0.178: U$1.53 28.42,25.69 26.31,27.79 26.31,37.74 29.21,40.64 29.21,43.18 23.49,43.18 JMP3.1
CODEC_RESET  (via drill 0.3)
  Top 0.178: U$1.61 24.42,25.1 24.36,25.16 24.36,26.44 v24.13,26.67 | v8.89,63.5 8.89,66.72 JMP1.3
  Bottom 0.178: v24.13,26.67 7.62,26.67 7.62,29.21 1.27,35.56 1.27,62.23 2.54,63.5 v8.89,63.5
DIN
  Top 0.178: 12.27,52.45 10.31,52.45 JMP4.1 | 12.27,52.45 25.78,52.45 28.63,49.61 31.65,49.61 U1.4 | JMP5.3 10.31,47.3 12.27,49.25 12.27,52.45
DIN_J3  (via drill 0.3)
  Top 0.178: v18.14,43.03 22.94,38.23 22.94,23.65 U$1.64 | v11.56,49.61 10.31,50.85 JMP4.2
  Bottom 0.178: v11.56,49.61 v18.14,43.03
DOUT
  Top 0.178: U1.5 31.65,49.07 28.63,49.07 26.85,50.85 24.54,50.85 16.54,42.85 16.54,40.01 16,39.47 13.51,39.47 JMP5.1 10.31,42.85 9.96,42.85 9.25,43.56 9.25,46.94 10.13,47.83 10.13,49.07 JMP4.3
DOUT_J3  (via drill 0.3)
  Top 0.178: v28.27,27.74 29.87,26.14 29.87,23.65 U$1.50 | v15.82,40.18 14.76,40.18 10.67,44.27 10.31,44.27 JMP5.2
  Bottom 0.178: v15.82,40.18 v28.27,27.74
FSYNC_IN
  Top 0.178: U1.3 31.65,50.14 28.8,50.14 20.09,58.85 JMP2.2
FSYNC_J3  (via drill 0.3)
  Top 0.178: v23.47,41.6 23.47,23.65 U$1.63 | v23.47,57.25 20.09,60.63 JMP2.1
  Bottom 0.178: v23.47,57.25 v23.47,41.6
JTAG_TCK  (via drill 0.3)
  Top 0.178: JTAG.3 18.54,3.05 15.24,6.35 v15.24,11.43 | U$1.19 23.92,14.19 23.61,13.88 23.28,13.88 22.86,13.46 22.35,13.46 v22.1,13.21
  Bottom 0.178: v15.24,11.43 15.24,11.68 16.76,13.21 v22.1,13.21
JTAG_TDI
  Top 0.178: 22.05,15.29 U$1.16 22.14,15.24 19.81,15.24 16.56,11.98 16.56,11.94 15.77,11.15 15.77,6.58 18.29,4.06 21.31,4.06 21.34,4.09 22.23,4.09 23.47,2.85 JTAG.5
JTAG_TDO
  Top 0.178: 22.94,14.4 U$1.17 22.92,14.28 22.61,13.97 19.3,13.97 16.26,10.92 16.26,6.86 18.69,4.42 21.16,4.42 21.19,4.45 24.54,4.45 26.14,2.85 JTAG.6
JTAG_TMS
  Top 0.178: U$1.20 24.36,14.4 24.36,13.96 24.14,13.75 24.14,13.73 23.88,13.46 23.62,13.46 22.86,12.7 22.4,12.7 22.34,12.64 21.86,12.64 21.8,12.7 18.8,12.7 16.76,10.67 16.76,6.86 18.8,4.83 19.05,4.83 19.07,4.8 25.96,4.8 27.38,3.38 27.38,2.13 26.67,1.42 22.4,1.42 21.16,2.67 JTAG.4
LOUT1
  Top 0.178: U2.2 51.74,70.41 51.38,70.41 46.76,75.03 46.76,86.41 47.47,87.12 60.98,87.12 67.21,80.9 67.21,72.72 TERMINAL_BLOCK.4
LOUT2  (via drill 0.3)
  Top 0.178: v51.74,64.54 51.74,68.99 U2.5
  Bottom 0.178: 67.21,70.59 TERMINAL_BLOCK.3 68.16,69.85 68.58,69.85 68.58,64.77 68.35,64.54 v51.74,64.54
MASTER_RESET  (via drill 0.3)
  Top 0.178: R8.1 6.04,44.45 | 6.04,44.45 6.76,44.45 C54.1 | v15.11,55.47 15.11,69.52 JMP1.1 | 6.04,44.45 v6.04,46.41
  Bottom 0.178: v6.04,46.41 v15.11,55.47
MICBIAS
  Top 0.178: U1.19 36.8,48.72 41.78,48.72 44.98,51.92 50.14,51.92 R5.2
N$1  (via drill 0.3)
  Top 0.178: C26.1 48.18,40.01 44.27,40.01 43.92,40.36 Y2.3 43.18,41.1 43.18,41.91 41.91,43.18 v38.1,43.18 | U$1.52 28.92,25.69 26.67,27.94 26.67,36.83 v30.48,40.64
  Bottom 0.178: v30.48,40.64 35.56,40.64 v38.1,43.18
N$2
  Top 0.178: 30.94,35.38 30.94,31.47 27.56,28.09 27.56,27.56 29.34,25.78 29.34,23.65 U$1.51 | 30.94,35.38 30.58,35.74 C25.1 | 30.94,35.38 33.6,38.05 40.01,38.05 Y2.1
N$3  (via drill 0.3)
  Top 0.178: C43.1 43.92,13.87 43.92,15.29 C45.1 43.92,15.47 43.92,16.71 C41.1 43.92,16.89 43.92,18.49 L7.1 43.74,18.67 v41.96,20.45 | v32.36,16.71 31.29,16.71 U$1.36 | U$1.48 31.29,22.94 v31.83,23.47 31.83,24.71 C31.1
  Bottom 0.178: v32.36,16.71 32.36,17.07 31.83,17.6 31.83,20.45 | v31.83,23.47 31.83,20.45 | 31.83,20.45 v41.96,20.45
N$4  (via drill 0.3)
  Top 0.178: v33.07,17.78 31.29,17.78 U$1.38 | v44.63,19.74 45.7,18.67 L7.2
  Bottom 0.178: v44.63,19.74 33.96,19.74 33.78,18.29 33.27,17.83 v33.07,17.78
N$6
  Top 0.178: SOP.4 44.81,3.38 | 47.12,3.38 SOP.2 | 44.63,3.38 SOP.4 | 42.32,3.38 SOP.6 SOP.4 | SOP.2 SOP.4 | SOP.2 47.25,3.31 R57.2
N$7
  Top 0.178: U$1.40 31.29,18.85 33.43,18.85 33.96,18.31 38.94,18.31 39.83,17.42 40.72,17.42 41.6,16.54 L6.2
N$8  (via drill 0.3)
  Top 0.178: v33.3,19.43 32.36,19.38 31.29,19.38 U$1.41 | v38.58,16.89 39.12,16.89 39.47,16.54 L6.1
  Bottom 0.178: v33.3,19.43 32.54,18.14 32.36,17.96 32.36,17.6 33.07,16.89 v38.58,16.89
N$9
  Top 0.178: FL1.1 29.87,12.45 | U$1.31 29.87,14.4
  Top 0.254: 29.87,14.4 29.92,14.35 FL1.1
N$10  (via drill 0.3)
  Top 0.178: C34.1 38.76,19.2 38.76,20.45 C36.1 | U$1.42 32.5,19.8 35.69,22.23 37.46,22.23 38.61,21.08 38.61,20.74 C36.1 | U$1.33 32,14.44 C42.1 34.45,12.45 v37.34,12.45 | v47.75,21.59 47.5,21.34 39.37,21.34 38.77,20.74 C36.1
  Bottom 0.178: v37.34,12.45 37.34,14.48 37.59,14.73 39.12,14.73 41.15,16.76 44.96,16.76 47.75,19.56 v47.75,21.59
N$11
  Top 0.178: 31.29,20.27 U$1.43 32.24,20.3 35.56,22.86 42.91,22.86 L5.2
N$12
  Top 0.178: U$1.45 31.53,21.3 31.84,21.61 31.84,22.06 34.04,24.26 36.31,24.26 R65.1
N$13  (via drill 0.3)
  Top 0.178: v43.03,9.96 41.25,9.96 R59.2 | U$1.35 31.96,16.3 33.02,15.24 34.29,13.97 v38.1,13.97
  Bottom 0.178: v43.03,9.96 44.98,9.96 45.7,10.67 46.05,10.67 48.04,8.67 | 48.04,8.67 48.54,8.18 48.54,5.33 47.83,4.62 43.38,4.62 SOP.5 | v38.1,13.97 39.37,12.7 48.26,12.7 48.26,8.89 48.04,8.67
N$14  (via drill 0.3)
  Top 0.178: U$1.32 30.4,14.4 30.4,14.05 30.48,13.97 v30.99,13.97 | C8.1 47.47,29.52 47.12,29.16 v46.58,29.16 45.87,29.87 45.87,32.36 R1.1
  Bottom 0.178: v46.58,29.16 46.58,19.91 44.45,17.78 40.64,17.78 38.1,15.24 34.29,15.24 33.02,13.97 v30.99,13.97
N$15
  cutout Top: 28.6,8.99 32.41,8.99 32.41,4.57 28.6,4.57
N$17  (via drill 0.3)
  Top 0.178: C28.1 11.02,17.6 12.27,17.6 C37.1 12.45,17.6 v16,17.6 | 22.05,18.85 U$1.9 20.47,18.8 v19.89,19.38 | U$1.56 26.85,23.65 26.85,24 v26.95,25.04 v26.57,26.57 | v38.76,27.03 C32.1 38.77,24.73 39.37,24.13 42.18,24.13 L5.1
  Bottom 0.178: v16,17.6 19.38,17.6 v19.89,19.38 | v38.76,27.03 38.76,31.11 37.52,32.36 30.05,32.36 28.98,31.29 28.98,27.2 v26.57,26.57 | 20.22,19.05 v19.89,19.38 | v26.95,25.04 26.31,25.04 25.65,24.38 20.57,24.38 20.07,23.88 20.07,19.56 v19.89,19.38
N$18
  Top 0.178: U$1.49 30.4,23.65 30.4,28.21 C30.1
N$19
  Top 0.178: 26.49,14.4 U$1.24 26.42,12.34 C44.1
N$20
  Top 0.178: U$1.47 31.29,22.23 31.47,22.23 34.49,25.25 R64.1 34.49,27.38 35.92,27.38 36.98,28.45 C27.1 37.16,28.45 41.07,32.36 43.03,32.36 R6.1
N$21  (via drill 0.3)
  Top 0.178: R58.2 44.09,10.13 42.72,8.87 41.68,8.89 v40.18,8.89 40.18,10.87 37.59,13.46 33.86,13.46 31.62,15.71 31.24,15.71 U$1.34
  Bottom 0.178: SOP.3 44.63,5.87 43.38,7.11 40.18,7.11 v40.18,8.89
N$22  (via drill 0.3)
  Top 0.178: v24.71,13.51 24.89,13.69 24.89,14.4 U$1.21 | v47.14,8.69 47.12,9.96 R61.2
  Bottom 0.178: 40.72,11.38 44.98,7.11 45.87,7.11 | 45.87,7.11 47.12,5.87 SOP.1 | 45.87,7.11 v47.14,8.69
  Bottom 0.254: v24.71,13.51 26.85,11.38 40.72,11.38
N$25
  Top 0.178: C3.1 36.8,48.18 U1.18
N$28
  Top 0.178: 25.43,14.4 U$1.22 | 25.4,14.55 U$1.22 | U$1.22 25.42,13.23 25.15,12.95 24.96,12.95 24.95,12.94 23.86,12.94 22.86,11.94 22.65,11.94 Y3.3 21.71,9.53 22.86,8.38 22.86,6.1 23.37,5.59 C47.1
N$29
  Top 0.178: U$1.23 25.92,13.05 25.73,12.86 25.73,12.77 25.15,12.19 25.15,8.43 24.36,7.64 | 24.36,7.64 Y3.1 | C48.1 24.89,7.11 24.36,7.64
N$30
  Top 0.178: U$1.14 22.1,16.21 19.51,16.21 18.55,15.24 12.7,15.24 9.14,11.68 6.1,11.68 4.7,13.08 U15.1
N$31
  Top 0.178: U$1.13 22.05,16.71 12.62,16.71 8.53,12.62 6.76,12.62 6.04,13.34 6.04,14.4 U15.2
N$32
  Top 0.178: U$1.12 22.05,17.25 17.25,17.25 12.62,21.87 8.53,21.87 U15.5
N$33
  Top 0.178: U$1.11 22.05,17.78 17.25,17.78 11.73,23.29 8,23.29 7.29,22.58 7.29,22.05 U15.6
N$34
  Top 0.178: 32.54,51.92 U1.32 30.7,51.85 27.94,54.61 27.94,60.96 33.02,66.04 33.02,66.19 TP3.1
N$35  (via drill 0.3)
  Top 0.178: v47.47,75.21 51.74,70.94 U2.1 | R2.2 9.96,59.21 9.96,56.36 3.73,50.14 JP1.2
  Bottom 0.178: v47.47,75.21 24.89,75.21 24.71,75.39 22.58,75.39 3.73,56.54 3.73,50.14 JP1.2
N$36
  Top 0.178: 30.05,11.73 FL1.3
  Top 0.254: FL1.3 L1.1
N$37
  Top 0.178: U1.29 33.96,51.92 33.96,56.82 33.99,56.85 33.74,57.09 33.74,60.41 34.29,60.96 34.29,69.85 31.75,72.39 29.13,72.39 28.63,72.9 23.29,72.9 22.05,71.65 13.16,71.65 11.2,73.61 C7.1
N$38
  Top 0.178: C22.2 8,74.14 7.82,74.14 7.29,74.68 7.29,79.12 7.47,79.3 J4.4 7.47,79.48 7.47,83.74 J4.3
N$39
  Top 0.178: U2.20 52.81,72.01 52.81,73.25 52.09,73.97 C14.2
N$41
  Top 0.178: C13.1 53.16,85.88 50.85,85.88 C15.1 50.67,86.06 48.36,86.06 R3.1
N$42
  Top 0.178: U2.19 53.34,72.01 53.34,74.14 51.56,75.92 48.01,75.92 47.47,76.45 47.47,78.77 53.16,84.45 C13.2
N$43  (via drill 0.3)
  Top 0.178: v55.83,79.12 54.41,77.7 54.41,72.01 U2.17 | v55.83,83.39 55.83,84.45 C16.2
  Bottom 0.178: v55.83,83.39 v55.83,79.12
N$44
  Top 0.178: C18.1 58.5,84.28 57.25,85.52 56.01,85.52 C16.1 55.83,85.7 50.14,80.01 50.14,77.17 R4.1
N$45
  Top 0.178: C17.2 61.34,83.74 54.94,77.34 54.94,72.01 U2.16
N$46
  Top 0.178: C21.2 18.49,75.39 18.49,79.12 18.14,79.48 J4.1 18.14,79.65 18.14,82.5 J4.2
N$55
  Top 0.178: C46.2 32.54,86.06 40.01,86.06 44.45,81.61 J3.2 44.63,81.43 44.63,78.41 J3.1
N$56
  Top 0.178: C49.2 33.96,73.61 33.96,78.23 J3.4 33.96,78.41 33.96,82.5 J3.3
N$57
  Top 0.178: 50.32,46.76 51.74,46.76 52.45,47.47 J1.2 | 50.32,46.76 49.07,46.76 C51.2 | 50.32,46.76 50.32,50.32 R5.1 50.32,50.49 52.81,50.49 54.94,52.63 J1.3
RESET_OUT
  Top 0.178: 33.07,51.92 U1.31 33.04,52.3 32.79,52.54 32.55,52.54 31.75,53.34 30.48,53.34 29.21,54.61 29.21,59.69 31.75,62.23 31.75,63.5 33.02,64.77 33.02,65.54 33.27,65.79 | JMP1.2 13.34,69.7 14.4,70.76 21.69,70.76 23.47,72.54 28.45,72.54 33.38,67.61 33.38,65.89 | 33.27,65.79 33.38,65.89 | 33.27,65.79 33.38,65.89
ROUT1  (via drill 0.3)
  Top 0.178: U2.14 55.83,70.41 58.98,70.41 v59.69,71.12
  Bottom 0.178: TERMINAL_BLOCK.2 64.89,71.12 v59.69,71.12
ROUT2
  Top 0.178: 55.83,68.99 U2.11 60.56,68.98 60.96,68.58 60.96,67.31 66.7,67.31 TERMINAL_BLOCK.1 67.21,66.85
SCL
  Top 0.178: U$1.1 22.05,22.94 22.05,38.23 17.42,42.85 17.42,43.2 24.71,50.49 26.67,50.49 26.67,49.53 26.88,49.32 26.88,48.47 28.37,46.99 29.21,46.99 30.48,45.72 31.75,45.72 32.54,46.51 U1.9 32.54,46.94
SDA  (via drill 0.3)
  Top 0.178: v21.34,35.56 21.34,22.76 21.87,22.23 22.05,22.23 U$1.2 | v31.47,44.27 31.47,44.81 33.07,46.41 33.07,46.76 U1.10
  Bottom 0.178: v21.34,35.56 22.76,35.56 v31.47,44.27
SJ_HPL
  Top 0.178: U1.25 36.09,51.92 36.09,60.98 36.45,61.34 36.45,72.72 C49.1
SJ_HPR
  Top 0.178: U1.27 35.03,51.92 35.03,70.94 30.76,75.21 30.76,86.06 C46.1
SJ_IN1L  (via drill 0.3)
  Top 0.178: v34.67,45.16 34.49,45.34 34.49,46.76 U1.13 | v33.07,43.56 31.29,43.56 v25.07,49.78 | v20.98,72.9 19.91,72.9 18.67,74.14 C21.1
  Bottom 0.178: v33.07,43.56 v34.67,45.16 | v25.07,49.78 25.07,68.28 20.98,72.36 v20.98,72.9
SJ_IN1R  (via drill 0.3)
  Top 0.178: v35.2,45.87 35.03,46.05 35.03,46.76 U1.14 | v8.89,75.92 8.18,75.21 C22.1
  Bottom 0.178: v35.2,45.87 35.2,46.23 51.03,62.05 51.03,64.72 52.27,65.96 55.3,65.96 58.14,68.81 58.14,75.92 49.61,84.45 40.89,84.45 32.36,75.92 v8.89,75.92
SJ_IN2R
  Top 0.178: U1.16 36.09,46.76 47.65,46.76 48.9,45.52 C51.1
SS  (via drill 0.3, 0.91)
  Top 0.178: C10.2 4.09,54.23 4.09,56.54 C9.2 4.09,56.72 4.09,59.03 C2.2 4.09,59.21 4.09,60.98 | 4.09,60.98 4.09,61.52 C1.2 | 4.09,60.98 7.29,60.98 | 7.29,60.98 9.96,60.98 R2.1 10.13,60.81 11.02,59.92 11.02,55.12 6.93,51.03 6.93,45.7 C54.2 6.93,45.52 7.11,45.52 7.64,44.98 7.64,43.92 5.87,42.14 4.45,42.14 C11.2 4.27,41.96 4.27,40.18 C12.2 4.27,40.01 4.27,38.05 C19.2 4.27,37.87 4.27,36.27 C20.2 4.45,36.09 2.85,34.49 2.85,30.76 JP91.1 2.67,30.58 2.67,29.52 1.42,28.27 1.42,20.27 | J4.5 17.96,85.7 17.96,84.45 16,82.5 16,75.56 C5.2 15.82,75.56 13.51,75.56 C6.2 13.34,75.56 11.2,75.56 C7.2 11.02,75.39 11.02,75.03 7.47,71.48 7.47,69.7 C52.- 7.29,69.52 7.29,60.98 | C37.2 12.27,18.67 11.02,18.67 C28.2 10.85,18.67 | 13.51,7.64 C39.2 13.69,7.47 | 13.69,5.16 16,2.85 JTAG.2 16,2.67 16.89,2.67 18.49,1.07 | 8.89,9.42 C35.2 | C3.2 44.45,48.18 43.56,47.3 42.14,47.3 41.78,47.65 36.79,47.65 U1.17 36.04,47.63 U1.33 33.88,49.38 | 54.59,64.72 C4.2 54.6,64.77 59.69,64.77 | 66.14,47.65 J1.1 66.04,47.4 | 52.81,53.52 52.81,53.16 | 29.16,12.09 FL1.2 | 30.58,12.09 FL1.4 | C41.2 44.98,16.71 44.98,15.47 C45.2 44.98,15.29 44.98,13.87 C43.2 44.98,13.69 44.98,11.38 | 42.85,11.38 44.09,11.38 R58.1 44.27,11.38 44.98,11.38 | 42.85,11.38 41.25,11.38 R59.1 41.07,11.38 | 44.98,11.38 47.12,11.38 R61.1 | C40.2 36.09,14.94 36.09,16.89 C38.2 36.27,17.07 36.8,17.6 v37.16,17.6 | v36.63,19.02 35.74,19.02 C33.2 | C36.2 40.01,20.45 40.01,19.2 C34.2 40.01,19.02 v41.07,19.02 42.85,17.25 42.85,11.38 | 45.7,83.57 44.63,84.63 J3.5 | U2.12 55.83,69.52 60.71,69.52 60.88,69.34 61.47,69.34 | 55.83,70.94 U2.15 | v52.09,72.54 51.03,73.61 51.03,73.97 C14.1
  Top 0.178: 53.87,78.05 53.87,72.01 U2.18 | 59.38,85.17 58.67,85.88 C18.2 58.5,86.06 57.78,86.77 47.65,86.77 47.47,86.59 47.47,83.57 48.01,83.03 49.61,83.03 50.67,84.1 C15.2 | 61.7,85.34 61.34,85.34 C17.1 | 33.96,40.54 33.96,46.76 U1.12 | 33.96,40.54 29.34,35.92 C25.2 29.34,35.74 28.27,34.67 28.27,32.72 C29.2 | 34.49,51.92 U1.28 34.54,57.1 v34.31,57.33 | 31.83,26.14 C31.2 31.75,28.36 C30.2 32.31,28.5 33.02,29.21 33.83,29.21 34.31,29.69 36.98,29.69 C27.2 37.16,29.87 37.16,31.29 | 49.07,30.58 49.96,29.69 49.96,29.52 C23.2 | 49.07,30.58 47.65,30.58 C8.2 | 49.07,30.58 49.96,31.47 49.96,34.14 C24.2 50.14,34.31 48.36,36.09 | 33.96,40.54 38.05,40.54 39.47,39.12 41.07,39.12 41.96,38.23 | 43.92,36.09 43.92,29.95 | 40.01,24.89 C32.2 40.64,25.56 40.64,26.67 | 48.36,38.76 C26.2 | 32.54,1.42 32.18,1.07 | v56.72,71.12 56.84,70.99 57.28,70.99 57.4,71.12 57.4,71.37 55.88,72.9 55.88,77.47 | 52.96,69.98 U2.21 53.32,69.48 U2.4 51.84,69.47 50.8,69.47 | 34.04,47.62 34.04,47.75 33.66,48.13 U1.7 | C47.2 25.91,5.59 26.42,6.1 26.42,7.02 C48.2 26.67,7.11 27.18,7.62 27.18,9.76 C44.2 | U15.4 8.52,14.48 v8.64,14.48
  Top 0.254: R61.1 46.99,11.32 | U1.33 34.29,47.88 34.04,47.62 U1.12 | U1.33 34.29,50.93 34.54,51.18 U1.28 | U1.33 34.29,49.28 | U1.33 33.76,49.38 | U2.18 U2.21 | U2.21 54.1,69.98 55.12,70.99 55.78,70.99 U2.15 56.5,70.98 56.64,71.12 | U2.21 54.61,69.98 55.12,69.47 55.79,69.47 U2.12 | L1.2 29.93,8.08 C50.1 29.89,7.33 U$3.FEED | C35.2 8.89,9.49 v8.89,9.4
  Bottom 0.178: v37.16,17.6 36.63,18.14 v36.63,19.02 v41.07,19.02 | v52.09,72.54 55.3,72.54 v56.72,71.12 | v34.31,57.33 35.74,57.33 | U$1.EXP 23.11,19.05
  Bottom 0.254: 9.74,14.58 9.62,14.46
  other vias: 26.67,19.05 66.8,55.88
  pour Top (isolate 0.406): 0.25,88.65 69.6,88.65 69.6,0.25 0.25,0.25
  pour Bottom (isolate 0.406): 0.51,88.39 69.34,88.39 69.34,0.51 0.51,0.51
V_BATT  (via drill 0.3)
  Top 0.178: C24.1 48.9,34.14 48.54,33.78 45.87,33.78 R1.2 45.7,33.6 44.98,32.89 44.98,29.87 | 48.9,28.45 48.9,29.34 C23.1 | 44.98,29.87 46.41,28.45 48.9,28.45 | 7.11,23.65 11.91,23.65 17.25,18.31 22.05,18.31 U$1.10 | 7.11,23.65 6.04,22.58 6.04,22.05 U15.7 | U15.8 4.8,22.05 5.87,22.05 U15.7 | U15.3 7.11,14.58 7.11,20.09 6.04,21.16 6.04,21.87 U15.7 | 13.34,9.07 13.51,8.89 C39.1 13.34,9.07 | 13.34,9.07 12.09,10.31 8.36,10.31 7.82,9.78 7.82,9.6 C35.1 | v12.62,8.36 13.34,9.07 | 31.29,20.8 U$1.44 31.92,20.8 v34.14,22.51 | 33.78,17.07 34.85,17.07 C38.1 | 33.78,17.07 33.07,17.07 | 33.07,17.07 32.89,17.07 32.54,17.42 32.18,17.42 32,17.25 31.29,17.25 U$1.37 | 33.78,17.07 33.78,17.96 33.25,18.49 32.89,18.49 32.72,18.31 31.29,18.31 U$1.39 | C40.1 35.03,14.94 35.03,16.89 C38.1 | v27.76,25.43 27.91,24 27.91,23.65 U$1.54 | v37.87,31.11 40.36,33.6 43.03,33.6 R6.2 | v30.23,31.65 29.34,32.54 C29.1 | v33.07,16.18 33.07,17.07 | 7.11,23.65 2.85,27.91 JP91.2 | v44.63,29.87 44.98,29.87 | C33.1 34.92,19.52 34.92,19.53 36.35,20.95 v36.35,21.13 | C38.1 34.96,17.18 v35.05,17.65 | R57.1 49.53,4.97 49.53,15.49 | 49.53,15.49 49.53,27.69 48.9,28.32 48.9,28.45 | IC1.2 59.23,15.62 C53.1 49.65,15.62 49.53,15.49
  Bottom 0.178: v12.62,8.36 12.62,3.56 13.34,2.85 JTAG.1 13.21,2.54 8.89,2.54 3.81,7.62 1.27,7.62 1.27,22.86 4.37,25.96 4.62,25.96 | 4.62,25.96 25.4,26.09 25.78,25.96 26.62,25.96 26.71,25.87 27.45,25.87 v27.76,25.43 29.52,26.67 | 4.62,25.96 2.85,27.74 JP91.2 | 29.52,26.67 32.36,29.52 | 32.36,29.52 33.96,31.11 v37.87,31.11 37.87,27.03 38.58,26.31 38.94,26.31 42.49,29.87 v44.63,29.87 | 32.36,29.52 v30.23,31.65 | v33.07,16.18 32.72,16.18 32.54,16 32.18,16 | v36.35,21.13 v34.14,22.51 32.54,23.65 29.52,26.67 | C33.1 34.45,18.25 v35.05,17.65
  other vias: 34.45,19.05
V_IN
  Top 0.178: IC1.3 59.59,11.01 J5.PWR 58.56,7.74 C55.1
VCC_BRD1  (via drill 0.3)
  Top 0.178: C52.+ 2.67,69.52 2.67,61.87 2.85,61.7 C1.1 3.02,61.52 3.02,59.21 C2.1 3.02,59.03 3.02,56.72 C9.1 2.85,56.54 2.85,54.23 C10.1 2.85,54.05 2.85,51.21 2.31,50.67 2.31,48.9 JP1.1 3.56,47.47 3.38,47.3 3.38,44.45 R8.2 3.2,44.45 3.2,42.14 C11.1 3.2,41.96 3.2,40.18 C12.1 3.2,40.01 3.2,38.05 C19.1 3.2,37.87 3.2,36.27 C20.1 | v54.05,67.03 54.41,67.39 54.41,67.92 U2.9 | v49.53,71.12 50.17,71.12 51.24,70.05 51.51,70.05 U2.3 | v57.15,73.66 62.23,73.66 63.5,72.39 63.5,71.12 62.36,69.98 U2.13 | U1.6 29.58,48.63 v29.21,48.26 | U1.30 33.45,51.95 33.45,52.39 31.75,54.09 v31.75,54.61
  Bottom 0.178: v54.05,67.03 52.27,67.03 | 52.27,67.03 36.27,51.03 36.27,47.83 33.43,44.98 29.21,44.98 | 29.21,44.98 27.74,44.98 23.65,40.89 10.31,40.89 JP1.1 | 52.27,67.03 49.81,67.03 49.53,67.31 v49.53,71.12 49.53,74.93 50.8,74.93 50.8,75.95 51.94,77.09 51.94,77.34 52.07,77.47 53.34,77.47 v57.15,73.66 | 29.21,44.98 v29.21,48.26 29.21,52.07 v31.75,54.61
VCCA
  Top 0.178: U2.8 53.7,68.1 53.34,68.1 U2.7 53.34,67.92 53.34,65.25 52.98,64.9 C4.1 52.81,64.72 51.92,63.83 49.43,63.83 36.8,51.21 U1.24

### Text on the board
Top: & TA | Team 10
Bottom: Team 10